# EAGLE design Slipring Ring (EAGLE 9.5.0)
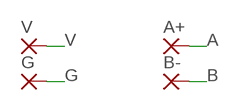
[diagram p0: schematic, sheet 1]

## Parts
A+  SMD2  [SMD1,27-2,54]
B-  SMD2  [SMD1,27-2,54]
G  SMD2  [SMD1,27-2,54]
V  SMD2  [SMD1,27-2,54]

## Nets
A [SIG]: A+.1(P)
B [SIG]: B-.1(P)
G: G.1(P)
V: V.1(P)

## Library data of the parts
A+ B- G V = wirepad:SMD2: SMD PAD

## Net classes
0 POWER: width 2.54 mm, drill 0.305 mm, clearance 0.152 mm
1 SIG: width 1.27 mm, drill 0.305 mm, clearance 0.152 mm

## Board
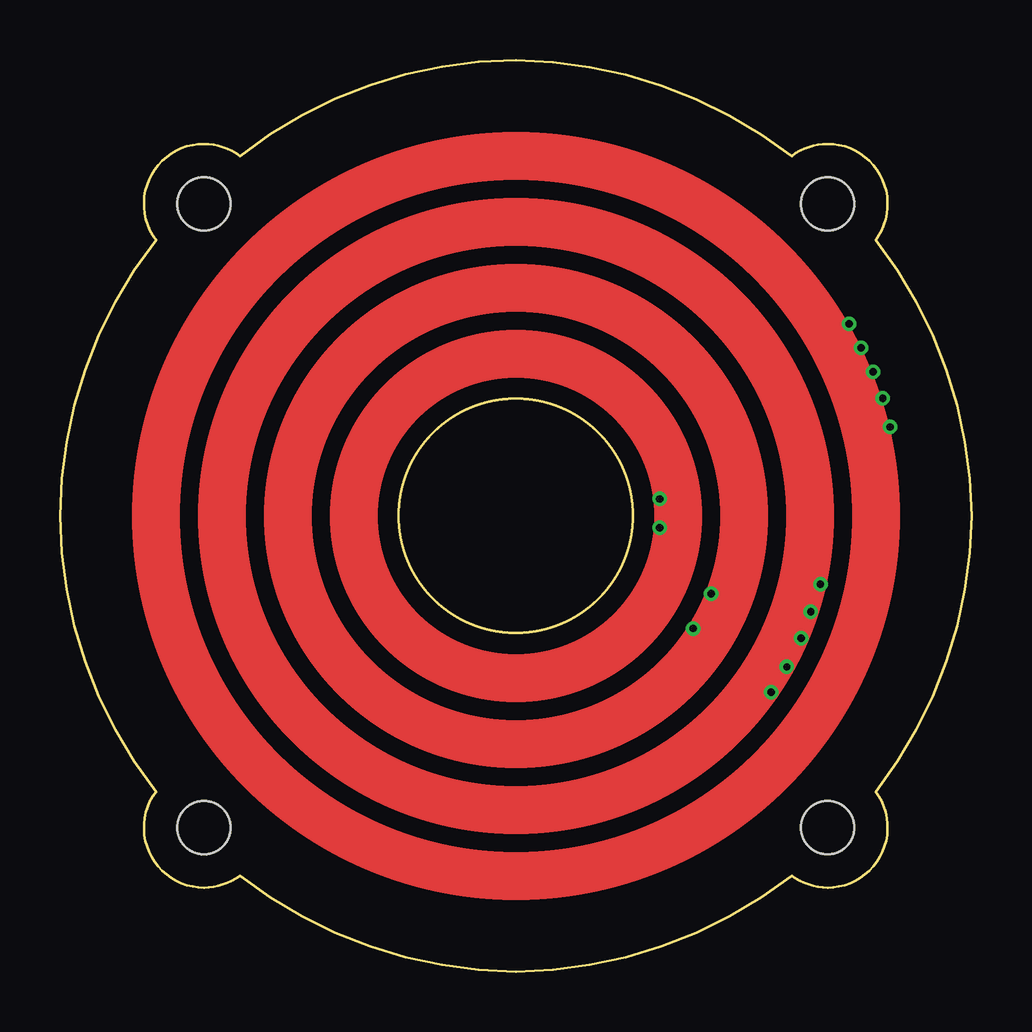
[diagram p1: board, top side]
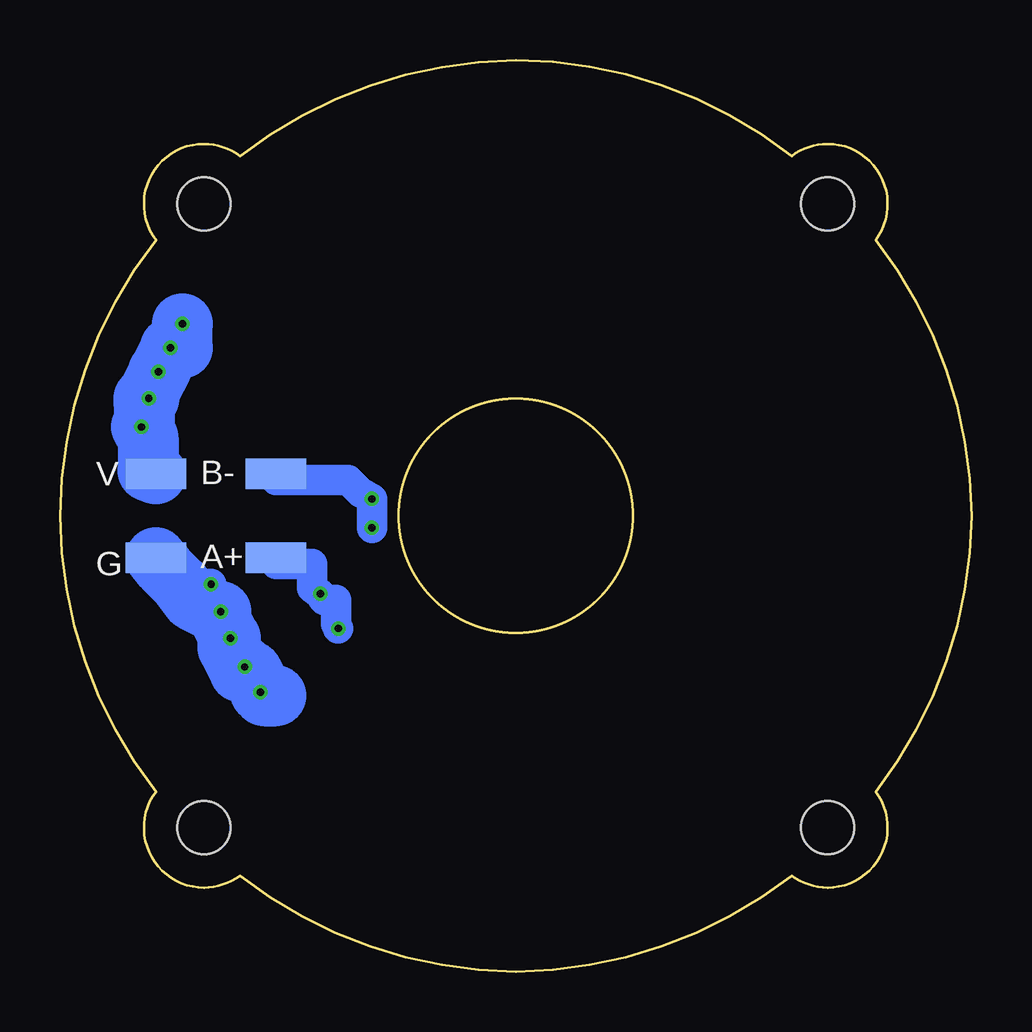
[diagram p2: board, bottom side, seen from below]

Size 38 x 38 mm. Coordinates in mm from the lower left corner, seen from the top.
Outline: 6,3.5 arc-127 4,7.5 arc-37 0,19 arc-37 4,30.5 arc-127 6,34.5 arc-37 7.5,34 arc-37 19,38 arc-37 30.5,34 arc-37 32,34.5 arc-127 34,30.5 arc-37 38,19 arc-37 34,7.5 arc-127 32,3.5 arc-37 30.5,4 arc-37 19,0 arc-37 7.5,4 arc-37 6,3.5
Outline: circle at 19,19 radius 4.88
Copper layers (1*16): Top 0.07mm / dielectric 1.55mm / Bottom 0.07mm
Design rules "default *": minimum track width 6mil, minimum drill 0.3mm, track to track 6mil, track to pad 6mil, pad to pad 6mil, via to via 6mil, smd to smd 0mil, copper to edge 8mil, drill to drill 10mil, minimum pad ring 10mil, minimum via ring 6mil, stop-mask expansion 4mil, vias tented up to drill 12mil, thermal gap 10mil
Holes 2.2 mm at 6,6 32,6 6,32 32,32

### Footprints (pad centres in the part's own frame; a part is rotated, then mirrored left to right if it is on the bottom)
SMD1,27-2,54 = smd 1.27 x 2.54: 1 0,0

### Placement (x,y rotation side)
A+  29,17.25 270 bottom
B-  29,20.75 270 bottom
G  34,17.25 270 bottom
V  34,20.75 270 bottom

### Tracks (layer width: path | path; a pad name or v marks a point on that pad's centre or on a via)
A  (via drill 0.3)
  Bottom 1.27: v26.4,14.3 26.5,14.5 26.5,15.5 27,15.5 v27.15,15.75 27.5,16 27.5,17 29,17 A+.1
B  (via drill 0.3)
  Bottom 1.27: v25,18.5 v25,19.7 25.5,20 26,20.5 29,20.5 B-.1
G  (via drill 0.3)
  Bottom 1.27: v31.7,16.15 32.98,16.15
  Bottom 2.54: 29,11.5 29.5,11.5 29.65,11.8 | 29.65,11.8 v29.65,11.65 | 30.5,12.5 30,12.5 29.65,11.8 | 30.5,12.5 v30.3,12.7 | 31,14 31,13.5 30.5,12.5 | 31,14 v30.9,13.9 | 31.5,15 v31.3,15 | 31.5,15 31,14 | 31.5,15 32.5,15.5 32.98,16.15 | 32.98,16.15 33.66,16.83 G.1 | 32.98,16.15
V  (via drill 0.3)
  Bottom 2.54: 34.5,23.7 34.5,23.9 v34.3,23.9 | 34.5,23.7 34.5,22.8 v34.6,22.7 34.33,22.27 34.33,20.87 V.1 | v32.9,27 32.9,26 v33.4,26 33.4,25.9 33.8,25.1 v33.9,25 33.9,24.9 34.5,23.7
(copper drawn outside any net)
  shapes: Top circle x4